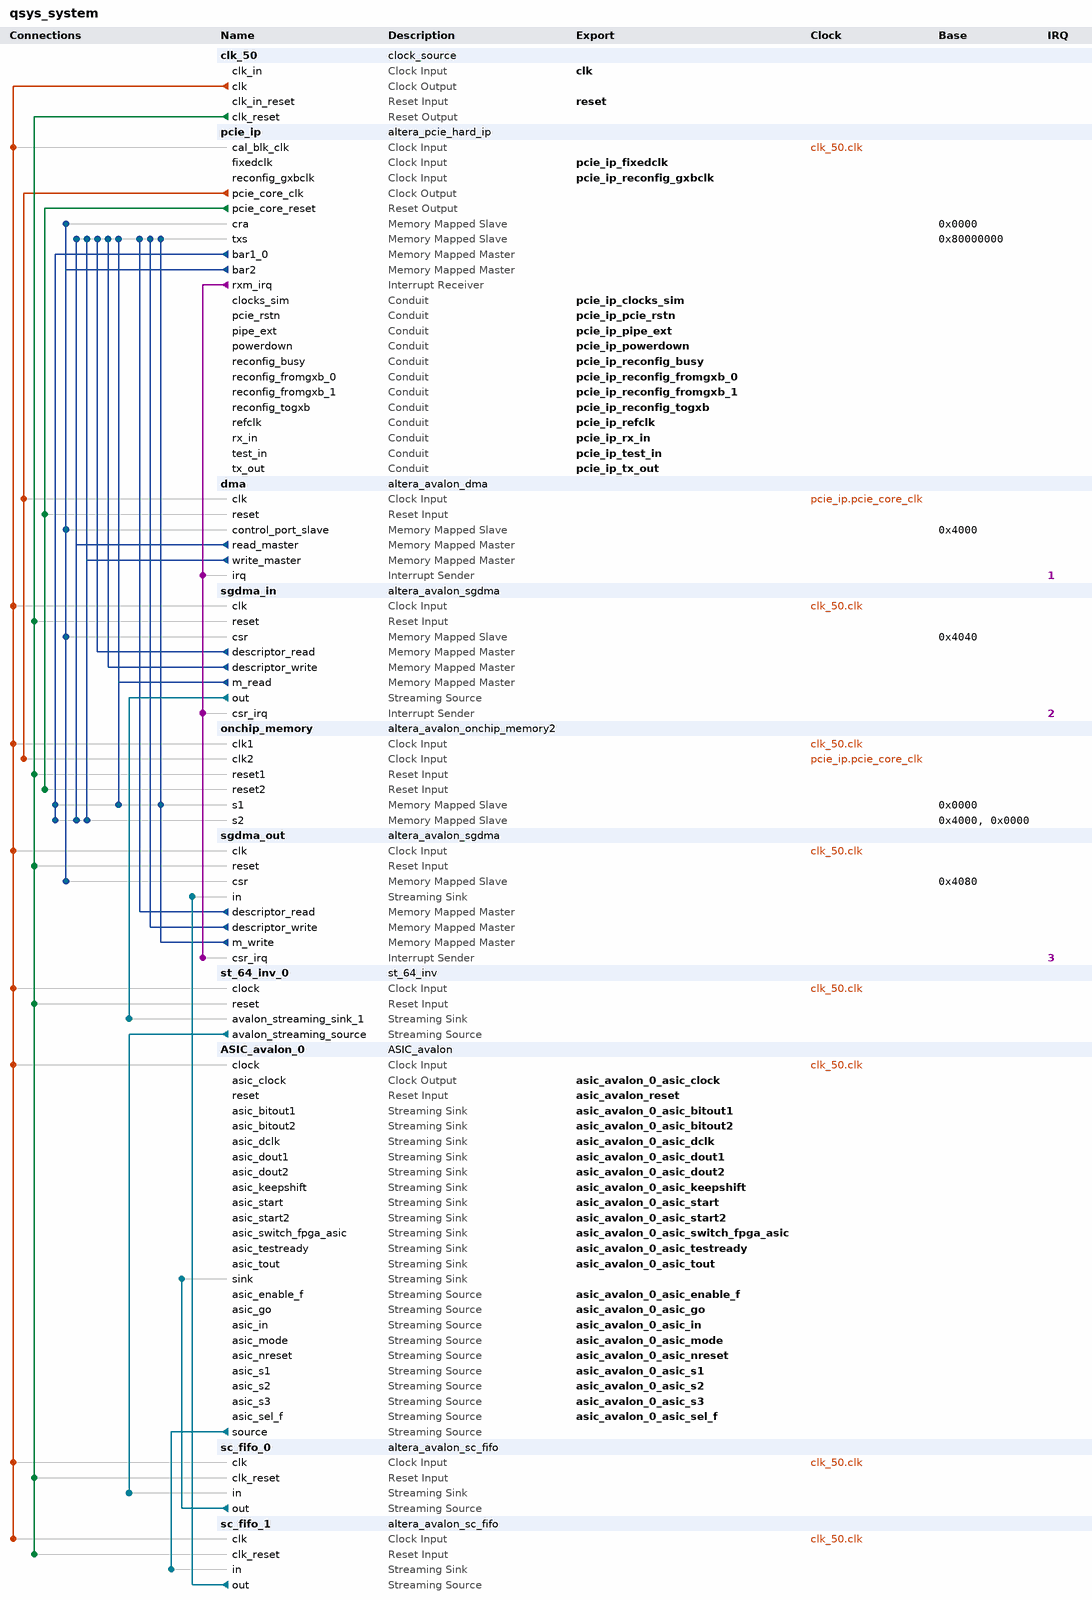
[diagram p0: system contents]
# Platform Designer (Qsys) system qsys_system, Stratix IV EP4SGX230KF40C2
# Parameters at their usual value, and those the tool derives, are not listed.
package require -exact qsys 16.0
create_system qsys_system
set_project_property DEVICE_FAMILY {Stratix IV}
set_project_property DEVICE EP4SGX230KF40C2

add_instance clk_50 clock_source 16.0
set_instance_parameter_value clk_50 clockFrequency 50000000

add_instance pcie_ip altera_pcie_hard_ip 16.0
set_instance_parameter_value pcie_ip {BAR Type} {64 bit Prefetchable,Not used,32 bit Non-Prefetchable,Not used,Not used,Not used}
set_instance_parameter_value pcie_ip CB_A2P_ADDR_MAP_PASS_THRU_BITS 31
set_instance_parameter_value pcie_ip CG_ENABLE_A2P_INTERRUPT 0
set_instance_parameter_value pcie_ip CG_NO_CPL_REORDERING 0
set_instance_parameter_value pcie_ip {PCIe Address 31:0} 0x00000000,0x00000000,0x00000000,0x00000000,0x00000000,0x00000000,0x00000000,0x00000000,0x00000000,0x00000000,0x00000000,0x00000000,0x00000000,0x00000000,0x00000000,0x00000000
set_instance_parameter_value pcie_ip {PCIe Address 63:32} 0x00000000,0x00000000,0x00000000,0x00000000,0x00000000,0x00000000,0x00000000,0x00000000,0x00000000,0x00000000,0x00000000,0x00000000,0x00000000,0x00000000,0x00000000,0x00000000
set_instance_parameter_value pcie_ip class_code 16711680
set_instance_parameter_value pcie_ip device_id 3556
set_instance_parameter_value pcie_ip max_link_width 8
set_instance_parameter_value pcie_ip my_advanced_errors false
set_instance_parameter_value pcie_ip my_enable_ecrc_check false
set_instance_parameter_value pcie_ip my_enable_ecrc_gen false
set_instance_parameter_value pcie_ip p_pcie_test_out_width None
set_instance_parameter_value pcie_ip p_user_msi_enable 0
set_instance_parameter_value pcie_ip subsystem_device_id 4
set_instance_parameter_value pcie_ip subsystem_vendor_id 4466
set_instance_parameter_value pcie_ip vendor_id 4466

add_instance dma altera_avalon_dma 16.0
set_instance_parameter_value dma allowByteTransactions false
set_instance_parameter_value dma allowDoubleWordTransactions true
set_instance_parameter_value dma allowHalfWordTransactions false
set_instance_parameter_value dma allowQuadWordTransactions false
set_instance_parameter_value dma allowWordTransactions false
set_instance_parameter_value dma burstEnable true
set_instance_parameter_value dma fifoDepth 32
set_instance_parameter_value dma maxBurstSize 1024
set_instance_parameter_value dma minimumDmaTransactionRegisterWidth 14

add_instance sgdma_in altera_avalon_sgdma 16.0
set_instance_parameter_value sgdma_in enableBurstTransfers true
set_instance_parameter_value sgdma_in enableUnalignedTransfers false
set_instance_parameter_value sgdma_in readBlockDataWidth 32
set_instance_parameter_value sgdma_in sinkErrorWidth 0
set_instance_parameter_value sgdma_in sourceErrorWidth 0
set_instance_parameter_value sgdma_in transferMode MEMORY_TO_STREAM
set_instance_parameter_value sgdma_in writeBurstcountWidth 4

add_instance onchip_memory altera_avalon_onchip_memory2 16.0
set_instance_parameter_value onchip_memory dataWidth 64
set_instance_parameter_value onchip_memory dualPort true
set_instance_parameter_value onchip_memory initMemContent true
set_instance_parameter_value onchip_memory initializationFileName onchip_memory
set_instance_parameter_value onchip_memory memorySize 12800

add_instance sgdma_out altera_avalon_sgdma 16.0
set_instance_parameter_value sgdma_out enableBurstTransfers true
set_instance_parameter_value sgdma_out enableUnalignedTransfers false
set_instance_parameter_value sgdma_out readBlockDataWidth 32
set_instance_parameter_value sgdma_out sinkErrorWidth 0
set_instance_parameter_value sgdma_out sourceErrorWidth 0
set_instance_parameter_value sgdma_out transferMode STREAM_TO_MEMORY
set_instance_parameter_value sgdma_out writeBurstcountWidth 4

add_instance st_64_inv_0 st_64_inv 1.0

add_instance ASIC_avalon_0 ASIC_avalon 1.0

add_instance sc_fifo_0 altera_avalon_sc_fifo 16.0
set_instance_parameter_value sc_fifo_0 BITS_PER_SYMBOL 8
set_instance_parameter_value sc_fifo_0 CHANNEL_WIDTH 0
set_instance_parameter_value sc_fifo_0 ERROR_WIDTH 0
set_instance_parameter_value sc_fifo_0 FIFO_DEPTH 1024
set_instance_parameter_value sc_fifo_0 SYMBOLS_PER_BEAT 4
set_instance_parameter_value sc_fifo_0 USE_FILL_LEVEL 1
set_instance_parameter_value sc_fifo_0 USE_MEMORY_BLOCKS 1
set_instance_parameter_value sc_fifo_0 USE_PACKETS 1
set_instance_parameter_value sc_fifo_0 USE_STORE_FORWARD 1

add_instance sc_fifo_1 altera_avalon_sc_fifo 16.0
set_instance_parameter_value sc_fifo_1 BITS_PER_SYMBOL 8
set_instance_parameter_value sc_fifo_1 CHANNEL_WIDTH 0
set_instance_parameter_value sc_fifo_1 ERROR_WIDTH 0
set_instance_parameter_value sc_fifo_1 FIFO_DEPTH 512
set_instance_parameter_value sc_fifo_1 SYMBOLS_PER_BEAT 4
set_instance_parameter_value sc_fifo_1 USE_FILL_LEVEL 1
set_instance_parameter_value sc_fifo_1 USE_MEMORY_BLOCKS 1
set_instance_parameter_value sc_fifo_1 USE_PACKETS 1
set_instance_parameter_value sc_fifo_1 USE_STORE_FORWARD 1

# connections
add_connection clk_50.clk ASIC_avalon_0.clock clock
add_connection clk_50.clk onchip_memory.clk1 clock
add_connection clk_50.clk pcie_ip.cal_blk_clk clock
add_connection clk_50.clk sc_fifo_0.clk clock
add_connection clk_50.clk sc_fifo_1.clk clock
add_connection clk_50.clk sgdma_in.clk clock
add_connection clk_50.clk sgdma_out.clk clock
add_connection clk_50.clk st_64_inv_0.clock clock
add_connection pcie_ip.pcie_core_clk dma.clk clock
add_connection pcie_ip.pcie_core_clk onchip_memory.clk2 clock
add_connection clk_50.clk_reset onchip_memory.reset1 reset
add_connection clk_50.clk_reset sc_fifo_0.clk_reset reset
add_connection clk_50.clk_reset sc_fifo_1.clk_reset reset
add_connection clk_50.clk_reset sgdma_in.reset reset
add_connection clk_50.clk_reset sgdma_out.reset reset
add_connection clk_50.clk_reset st_64_inv_0.reset reset
add_connection pcie_ip.pcie_core_reset dma.reset reset
add_connection pcie_ip.pcie_core_reset onchip_memory.reset2 reset
add_connection dma.read_master onchip_memory.s2 avalon
set_connection_parameter_value dma.read_master/onchip_memory.s2 baseAddress 0x0000
add_connection dma.read_master pcie_ip.txs avalon
set_connection_parameter_value dma.read_master/pcie_ip.txs baseAddress 0x80000000
add_connection dma.write_master onchip_memory.s2 avalon
set_connection_parameter_value dma.write_master/onchip_memory.s2 baseAddress 0x0000
add_connection dma.write_master pcie_ip.txs avalon
set_connection_parameter_value dma.write_master/pcie_ip.txs baseAddress 0x80000000
add_connection pcie_ip.bar1_0 onchip_memory.s1 avalon
set_connection_parameter_value pcie_ip.bar1_0/onchip_memory.s1 baseAddress 0x0000
add_connection pcie_ip.bar1_0 onchip_memory.s2 avalon
set_connection_parameter_value pcie_ip.bar1_0/onchip_memory.s2 baseAddress 0x4000
add_connection pcie_ip.bar2 dma.control_port_slave avalon
set_connection_parameter_value pcie_ip.bar2/dma.control_port_slave baseAddress 0x4000
add_connection pcie_ip.bar2 pcie_ip.cra avalon
set_connection_parameter_value pcie_ip.bar2/pcie_ip.cra baseAddress 0x0000
add_connection pcie_ip.bar2 sgdma_in.csr avalon
set_connection_parameter_value pcie_ip.bar2/sgdma_in.csr baseAddress 0x4040
add_connection pcie_ip.bar2 sgdma_out.csr avalon
set_connection_parameter_value pcie_ip.bar2/sgdma_out.csr baseAddress 0x4080
add_connection sgdma_in.descriptor_read pcie_ip.txs avalon
set_connection_parameter_value sgdma_in.descriptor_read/pcie_ip.txs baseAddress 0x80000000
add_connection sgdma_in.descriptor_write pcie_ip.txs avalon
set_connection_parameter_value sgdma_in.descriptor_write/pcie_ip.txs baseAddress 0x80000000
add_connection sgdma_in.m_read onchip_memory.s1 avalon
set_connection_parameter_value sgdma_in.m_read/onchip_memory.s1 baseAddress 0x0000
add_connection sgdma_in.m_read pcie_ip.txs avalon
set_connection_parameter_value sgdma_in.m_read/pcie_ip.txs baseAddress 0x80000000
add_connection sgdma_out.descriptor_read pcie_ip.txs avalon
set_connection_parameter_value sgdma_out.descriptor_read/pcie_ip.txs baseAddress 0x80000000
add_connection sgdma_out.descriptor_write pcie_ip.txs avalon
set_connection_parameter_value sgdma_out.descriptor_write/pcie_ip.txs baseAddress 0x80000000
add_connection sgdma_out.m_write onchip_memory.s1 avalon
set_connection_parameter_value sgdma_out.m_write/onchip_memory.s1 baseAddress 0x0000
add_connection sgdma_out.m_write pcie_ip.txs avalon
set_connection_parameter_value sgdma_out.m_write/pcie_ip.txs baseAddress 0x80000000
add_connection ASIC_avalon_0.source sc_fifo_1.in avalon_streaming
add_connection sc_fifo_0.out ASIC_avalon_0.sink avalon_streaming
add_connection sc_fifo_1.out sgdma_out.in avalon_streaming
add_connection sgdma_in.out st_64_inv_0.avalon_streaming_sink_1 avalon_streaming
add_connection st_64_inv_0.avalon_streaming_source sc_fifo_0.in avalon_streaming
add_connection pcie_ip.rxm_irq dma.irq interrupt
set_connection_parameter_value pcie_ip.rxm_irq/dma.irq irqNumber 1
add_connection pcie_ip.rxm_irq sgdma_in.csr_irq interrupt
set_connection_parameter_value pcie_ip.rxm_irq/sgdma_in.csr_irq irqNumber 2
add_connection pcie_ip.rxm_irq sgdma_out.csr_irq interrupt
set_connection_parameter_value pcie_ip.rxm_irq/sgdma_out.csr_irq irqNumber 3

# exported interfaces
add_interface asic_avalon_0_asic_bitout1 avalon_streaming sink
set_interface_property asic_avalon_0_asic_bitout1 EXPORT_OF ASIC_avalon_0.asic_bitout1
add_interface asic_avalon_0_asic_bitout2 avalon_streaming sink
set_interface_property asic_avalon_0_asic_bitout2 EXPORT_OF ASIC_avalon_0.asic_bitout2
add_interface asic_avalon_0_asic_clock clock source
set_interface_property asic_avalon_0_asic_clock EXPORT_OF ASIC_avalon_0.asic_clock
add_interface asic_avalon_0_asic_dclk avalon_streaming sink
set_interface_property asic_avalon_0_asic_dclk EXPORT_OF ASIC_avalon_0.asic_dclk
add_interface asic_avalon_0_asic_dout1 avalon_streaming sink
set_interface_property asic_avalon_0_asic_dout1 EXPORT_OF ASIC_avalon_0.asic_dout1
add_interface asic_avalon_0_asic_dout2 avalon_streaming sink
set_interface_property asic_avalon_0_asic_dout2 EXPORT_OF ASIC_avalon_0.asic_dout2
add_interface asic_avalon_0_asic_enable_f avalon_streaming source
set_interface_property asic_avalon_0_asic_enable_f EXPORT_OF ASIC_avalon_0.asic_enable_f
add_interface asic_avalon_0_asic_go avalon_streaming source
set_interface_property asic_avalon_0_asic_go EXPORT_OF ASIC_avalon_0.asic_go
add_interface asic_avalon_0_asic_in avalon_streaming source
set_interface_property asic_avalon_0_asic_in EXPORT_OF ASIC_avalon_0.asic_in
add_interface asic_avalon_0_asic_keepshift avalon_streaming sink
set_interface_property asic_avalon_0_asic_keepshift EXPORT_OF ASIC_avalon_0.asic_keepshift
add_interface asic_avalon_0_asic_mode avalon_streaming source
set_interface_property asic_avalon_0_asic_mode EXPORT_OF ASIC_avalon_0.asic_mode
add_interface asic_avalon_0_asic_nreset avalon_streaming source
set_interface_property asic_avalon_0_asic_nreset EXPORT_OF ASIC_avalon_0.asic_nreset
add_interface asic_avalon_0_asic_s1 avalon_streaming source
set_interface_property asic_avalon_0_asic_s1 EXPORT_OF ASIC_avalon_0.asic_s1
add_interface asic_avalon_0_asic_s2 avalon_streaming source
set_interface_property asic_avalon_0_asic_s2 EXPORT_OF ASIC_avalon_0.asic_s2
add_interface asic_avalon_0_asic_s3 avalon_streaming source
set_interface_property asic_avalon_0_asic_s3 EXPORT_OF ASIC_avalon_0.asic_s3
add_interface asic_avalon_0_asic_sel_f avalon_streaming source
set_interface_property asic_avalon_0_asic_sel_f EXPORT_OF ASIC_avalon_0.asic_sel_f
add_interface asic_avalon_0_asic_start avalon_streaming sink
set_interface_property asic_avalon_0_asic_start EXPORT_OF ASIC_avalon_0.asic_start
add_interface asic_avalon_0_asic_start2 avalon_streaming sink
set_interface_property asic_avalon_0_asic_start2 EXPORT_OF ASIC_avalon_0.asic_start2
add_interface asic_avalon_0_asic_switch_fpga_asic avalon_streaming sink
set_interface_property asic_avalon_0_asic_switch_fpga_asic EXPORT_OF ASIC_avalon_0.asic_switch_fpga_asic
add_interface asic_avalon_0_asic_testready avalon_streaming sink
set_interface_property asic_avalon_0_asic_testready EXPORT_OF ASIC_avalon_0.asic_testready
add_interface asic_avalon_0_asic_tout avalon_streaming sink
set_interface_property asic_avalon_0_asic_tout EXPORT_OF ASIC_avalon_0.asic_tout
add_interface asic_avalon_reset reset sink
set_interface_property asic_avalon_reset EXPORT_OF ASIC_avalon_0.reset
add_interface clk clock sink
set_interface_property clk EXPORT_OF clk_50.clk_in
add_interface pcie_ip_clocks_sim conduit end
set_interface_property pcie_ip_clocks_sim EXPORT_OF pcie_ip.clocks_sim
add_interface pcie_ip_fixedclk clock sink
set_interface_property pcie_ip_fixedclk EXPORT_OF pcie_ip.fixedclk
add_interface pcie_ip_pcie_rstn conduit end
set_interface_property pcie_ip_pcie_rstn EXPORT_OF pcie_ip.pcie_rstn
add_interface pcie_ip_pipe_ext conduit end
set_interface_property pcie_ip_pipe_ext EXPORT_OF pcie_ip.pipe_ext
add_interface pcie_ip_powerdown conduit end
set_interface_property pcie_ip_powerdown EXPORT_OF pcie_ip.powerdown
add_interface pcie_ip_reconfig_busy conduit end
set_interface_property pcie_ip_reconfig_busy EXPORT_OF pcie_ip.reconfig_busy
add_interface pcie_ip_reconfig_fromgxb_0 conduit end
set_interface_property pcie_ip_reconfig_fromgxb_0 EXPORT_OF pcie_ip.reconfig_fromgxb_0
add_interface pcie_ip_reconfig_fromgxb_1 conduit end
set_interface_property pcie_ip_reconfig_fromgxb_1 EXPORT_OF pcie_ip.reconfig_fromgxb_1
add_interface pcie_ip_reconfig_gxbclk clock sink
set_interface_property pcie_ip_reconfig_gxbclk EXPORT_OF pcie_ip.reconfig_gxbclk
add_interface pcie_ip_reconfig_togxb conduit end
set_interface_property pcie_ip_reconfig_togxb EXPORT_OF pcie_ip.reconfig_togxb
add_interface pcie_ip_refclk conduit end
set_interface_property pcie_ip_refclk EXPORT_OF pcie_ip.refclk
add_interface pcie_ip_rx_in conduit end
set_interface_property pcie_ip_rx_in EXPORT_OF pcie_ip.rx_in
add_interface pcie_ip_test_in conduit end
set_interface_property pcie_ip_test_in EXPORT_OF pcie_ip.test_in
add_interface pcie_ip_tx_out conduit end
set_interface_property pcie_ip_tx_out EXPORT_OF pcie_ip.tx_out
add_interface reset reset sink
set_interface_property reset EXPORT_OF clk_50.clk_in_reset

set_interconnect_requirement {$system} qsys_mm.clockCrossingAdapter HANDSHAKE
set_interconnect_requirement {$system} qsys_mm.enableEccProtection FALSE
set_interconnect_requirement {$system} qsys_mm.insertDefaultSlave FALSE
set_interconnect_requirement {$system} qsys_mm.maxAdditionalLatency 1

save_system qsys_system.qsys
